# EAGLE schematic test (EAGLE 6.6.0)
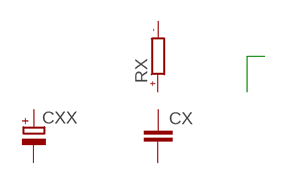
[diagram p0: schematic, sheet 1]

## Parts
CX  C-EU025-024X044  [C025-024X044]
CXX  CPOL-EU085CS-1AR  [085CS_1AR]
RX  R-EU_0204/5  [0204/5]
Unconnected: CX.1 CX.2 CXX.+ CXX.- RX.1 RX.2

## Library data of the parts
CX = rcl:C-EU: CAPACITOR, European symbol; VITRUV_ID: 2
CXX = rcl:CPOL-EU: POLARIZED CAPACITOR, European symbol; VITRUV_ID: 1
RX = rcl:R-EU_: RESISTOR, European symbol; VITRUV_ID: 0